# EAGLE schematic Clock (EAGLE 8.3.2)
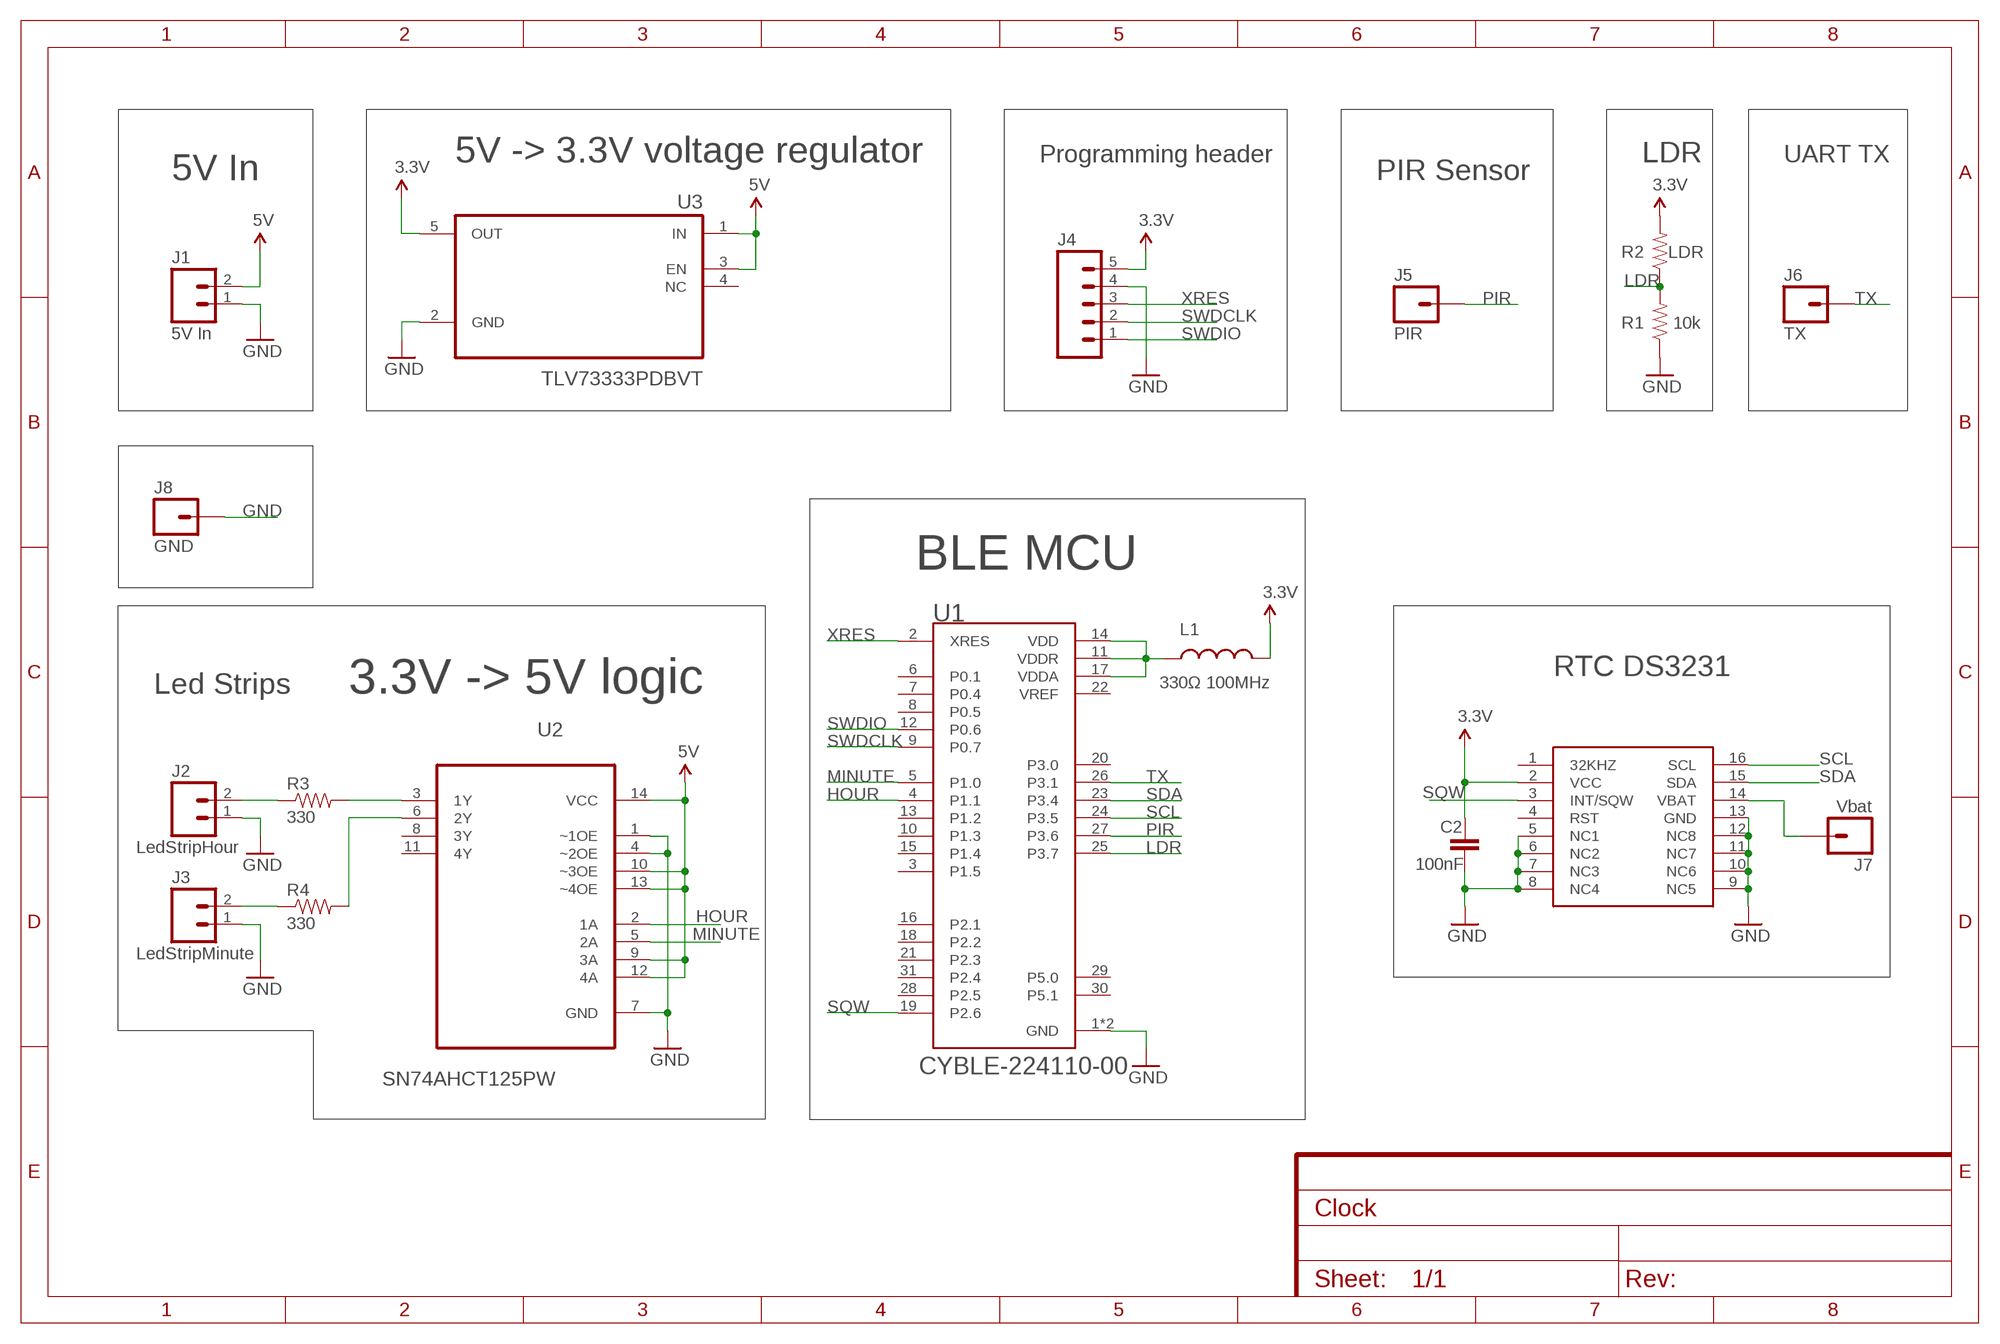
[diagram p0: schematic, sheet 1]
CLOCK_SCHEMATIC (FRAME-A4L): CNAME: Clock; CREVISION: B; DESIGNER: Tymek Feldman

## Parts
C2  100nF  CAP0603-CAP  [0603-CAP]
J1  5V In  M02PTH  [1X02]
J2  LedStripHour  M02PTH3  [1X02_LONGPADS]
J3  LedStripMinute  M02PTH3  [1X02_LONGPADS]
J4  M05PTH  [1X05]
J5  PIR  M01SMD  [LUXEON-PAD]
J6  TX  M01SMD  [LUXEON-PAD]
J7  Vbat  M01SMD  [LUXEON-PAD]
J8  GND  M01SMD  [LUXEON-PAD]
L1  330Ω 100MHz  INDUCTOR0805  [0805]
R1  10k  RESISTOR0603-RES  [0603-RES]
R2  LDR  RESISTOR0805-RES  [0805]
R3  330  RESISTORPTH-1/4W  [AXIAL-0.4]
R4  330  RESISTORPTH-1/4W  [AXIAL-0.4]
U1  CYBLE-224110-00  [CYPRESS_CYBLE-224110-00]
U2  SN74AHCT125PW  [SOP65P640X120-14N]
U3  TLV73333PDBVT  [SOT95P280X145-5N]
U$1  DS3231  [SO16W]

## Nets
3.3V: C2.1 J4.5 L1.2 R2.2 U3.5(OUT) U$1.2(VCC)
5V: J1.2 U2.9(3A) U2.10(~3OE) U2.12(4A) U2.13(~4OE) U2.14(VCC) U3.1(IN) U3.3(EN)
GND: C2.2 J1.1 J2.1 J3.1 J4.4 J8.P$1 R1.1 U1.1(GND) U1.32(GND) U2.1(~1OE) U2.4(~2OE) U2.7(GND) U3.2(GND) U$1.5(NC1) U$1.6(NC2) U$1.7(NC3) U$1.8(NC4) U$1.9(NC5) U$1.10(NC6) U$1.11(NC7) U$1.12(NC8) U$1.13(GND)
HOUR: U1.4(P1.1) U2.2(1A)
HOURTRACE: R3.P$2 U2.3(1Y)
LDR: R1.2 R2.1 U1.25(P3.7)
MINUTE: U1.5(P1.0) U2.5(2A)
MINUTETRACE: R4.P$2 U2.6(2Y)
N$1: J2.2 R3.P$1
N$2: J3.2 R4.P$1
N$4: J7.P$1 U$1.14(VBAT)
N$5: L1.1 U1.11(VDDR) U1.14(VDD) U1.17(VDDA)
PIR: J5.P$1 U1.27(P3.6)
SCL: U1.24(P3.5) U$1.16(SCL)
SDA: U1.23(P3.4) U$1.15(SDA)
SQW: U1.19(P2.6) U$1.3(INT/SQW)
SWDCLK: J4.2 U1.9(P0.7)
SWDIO: J4.1 U1.12(P0.6)
TX: J6.P$1 U1.26(P3.1)
XRES: J4.3 U1.2(XRES)
Unconnected: U1.3(P1.5) U1.6(P0.1) U1.7(P0.4) U1.8(P0.5) U1.10(P1.3) U1.13(P1.2) U1.15(P1.4) U1.16(P2.1) U1.18(P2.2) U1.20(P3.0) U1.21(P2.3) U1.28(P2.5) U1.29(P5.0) U1.30(P5.1) U1.31(P2.4) U2.8(3Y) U2.11(4Y) U3.4(NC) U$1.1(32KHZ) U$1.4(RST)

## Notes on the sheet
- 5V -> 3.3V voltage regulator | Programming header | LDR | UART TX
- 5V In | PIR Sensor
- BLE MCU
- RTC DS3231
- Led Strips | 3.3V -> 5V logic

## Power pins joined to a net without a drawn wire
VREF: U1.22(VREF)

## Library data of the parts
C2 = SparkFun-Capacitors:CAP: Capacitor Standard 0603 ceramic capacitor, and 0.1" leaded capacitor.
J1-J3 = SparkFun-Connectors:M02: Standard 2-pin 0.1" header. Use with - straight break away headers ( PRT-00116) - right angle break away headers (PRT-00553) - swiss pins (PRT-00743) - machine pins (PRT-00117) - female headers (PRT-00115) Molex polarized connector foot print use with: PRT-08233 with associated crimp pins and housings. 2.54_SCREWTERM for use with PRT-10571. 3.5mm Screw Terminal footprints for PRT-08084 5mm Screw Terminal footprints for use with PRT-08432
J4 = SparkFun-Connectors:M05: Header 5 Standard 5-pin 0.1" header. Use with straight break away headers (SKU : PRT-00116), right angle break away headers (PRT-00553), swiss pins (PRT-00743), machine pins (PRT-00117), and female headers (PRT-00115). Molex polarized connector foot print use with SKU : PRT-08230 with associated crimp pins and housings.
J5-J8 = SparkFun-Connectors:M01: Header 1 Standard 1-pin 0.1" header. Use with straight break away headers (SKU : PRT-00116), right angle break away headers (PRT-00553), swiss pins (PRT-00743), machine pins (PRT-00117), and female headers (PRT-00115). SMTSO-256-ET is a "flush mount" nut for a 4-40 screw. The older package used to be too tight, and did not allow it to sit properly thru the drill hit. The latest (0.165DIA) fits nice and snug.
L1 = SparkFun-Passives:INDUCTOR: Inductors Basic Inductor/Choke - 0603 and 1206. Footprints are not proven and vary greatly between part numbers. INDUCTOR POWER 3.3UH 4.0A SMD 0.197" L x 0.197" W x 0.177" H (5.00mm x 5.00mm x 4.50mm)
R1 R2 = SparkFun-Resistors:RESISTOR: Resistor Basic schematic elements and footprints for 0603, 1206, and PTH resistors.
R3 R4 = SparkFun-Passives:RESISTOR: Resistor Basic schematic elements and footprints for 0603, 1206, and PTH resistors.
U1 = CYBLE-224110-00:CYBLE-224110-00: CYBLE-224110-00 Series 1 Mbps 16.4 mA EZ-BLE PRoC Bluetooth Module; AVAILABILITY: Warning; DESCRIPTION: Bluetooth Class II 1.8 to 5.5V 1000Kbps 32-Pin SMD T/R; MF: Cypress Semiconductor; MP: CYBLE-224110-00; PACKAGE: Module Cypress Semiconductor; PRICE: 16.02 USD
U2 = SN74AHCT125PW:SN74AHCT125PW: Quad Bus Buffer; DESCRIPTION: IC BUS BUFFER TRI-ST QD 14TSSOP; DIGI-KEY_PART_NUMBER: 296-26414-5-ND; DIGI-KEY_PURCHASE_URL: https://www.digikey.nl/product-detail/en/texas-instruments/SN74AHCT125PW/296-26414-5-ND/1567014?WT.z_cid=ref_snapeda&utm_source=snapeda&utm_medium=aggregator&utm_campaign=buynow; MF: Texas Instruments; MP: SN74AHCT125PW; PACKAGE: TSSOP-14 Texas Instruments
U3 = TLV73333PDBVT:TLV73333PDBVT: None; AVAILABILITY: Good; DESCRIPTION: IC REG LINEAR 3.3V 300MA SOT23-5; MF: Texas Instruments; MP: TLV73333PDBVT; PACKAGE: SOT-23-5 Texas Instruments; PRICE: 0.24 USD
U$1 = DS3231:DS3231